# Altium schematic sheet board_One.SchDoc
size A4; SheetNumber: 1; SheetTotal: 1
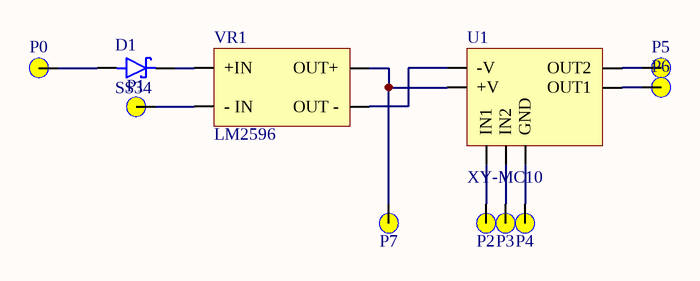
[diagram p0: board_One.SchDoc]

## Parts
D1  SS34  [DIOM7959X265N]  (no BOM)
P0  PIN_1  [PCB_Pin_1]  (value not drawn)  (no BOM)
P1  PIN_1  [PCB_Pin_1]  (value not drawn)  (no BOM)
P2  PIN_1  [PCB_Pin_1]  (value not drawn)  (no BOM)
P3  PIN_1  [PCB_Pin_1]  (value not drawn)  (no BOM)
P4  PIN_1  [PCB_Pin_1]  (value not drawn)  (no BOM)
P5  PIN_1  [PCB_Pin_1]  (value not drawn)  (no BOM)
P6  PIN_1  [PCB_Pin_1]  (value not drawn)  (no BOM)
P7  PIN_1  [PCB_Pin_1]  (value not drawn)  (no BOM)
U1  XY-MC10  [PCB_XY-MC10]
VR1  LM2596  [DC-DC Step-Down Footprint]  (no BOM)

## Nets
NetD1_A: D1.A P0.0(Pin)
NetD1_C: D1.C(K) VR1.1(+IN)
NetP1_0: P1.0(Pin) VR1.0(-_IN)
NetP2_0: P2.0(Pin) U1.2(IN1)
NetP3_0: P3.0(Pin) U1.3(IN2)
NetP4_0: P4.0(Pin) U1.4(GND)
NetP5_0: P5.0(Pin) U1.6(OUT2)
NetP6_0: P6.0(Pin) U1.5(OUT1)
NetP7_0: P7.0(Pin) U1.1(+V) VR1.2(OUT+)
NetU1_0: U1.0(-V) VR1.3(OUT_-)

## Library data of the parts
D1 = Diode_SS34: SS34 - діод Шоттки; MF: onsemi; SnapEDA_Link: https://www.snapeda.com/parts/SS34/Onsemi/view-part/?ref=snap; Package: SMC-2 ON Semiconductor; Value: *; MP: SS34; Check_prices: https://www.snapeda.com/parts/SS34/Onsemi/view-part/?ref=eda
VR1 = DC-DC Step-Down: DC-DC конвертер знижуючий 4.5...40В на 1.5...35В на LM2596